# Altium schematic sheet LED Section.SchDoc
size A; DocumentNumber: 6; SheetNumber: 8; SheetTotal: 30
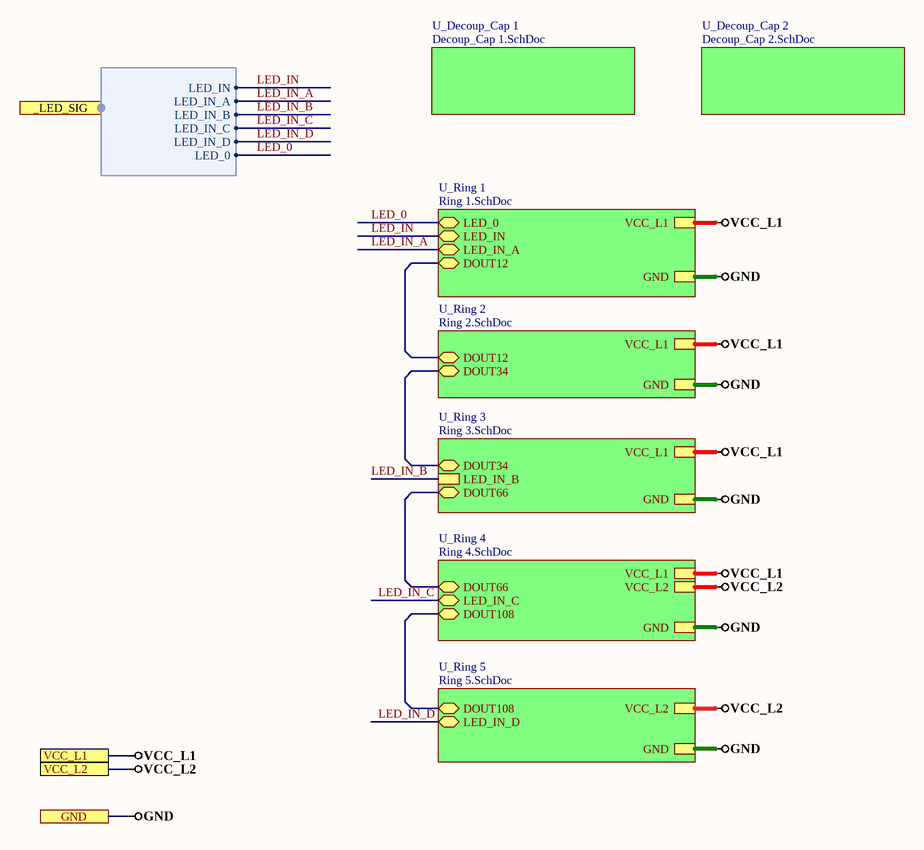
[diagram p0: LED Section.SchDoc]

## Sub-sheets
U_Decoup_Cap 1 = Decoup_Cap 1.SchDoc: no entries
U_Decoup_Cap 2 = Decoup_Cap 2.SchDoc: no entries
U_Ring 1 = Ring 1.SchDoc: DOUT12 (bidir), LED_IN (bidir), GND, VCC_L1, LED_IN_A (bidir), LED_0 (bidir)
U_Ring 2 = Ring 2.SchDoc: DOUT12 (bidir), DOUT34 (bidir), GND, VCC_L1
U_Ring 3 = Ring 3.SchDoc: DOUT34 (bidir), DOUT66 (bidir), GND, VCC_L1, LED_IN_B
U_Ring 4 = Ring 4.SchDoc: DOUT108 (bidir), DOUT66 (bidir), GND, VCC_L2, VCC_L1, LED_IN_C (bidir)
U_Ring 5 = Ring 5.SchDoc: DOUT108 (bidir), GND, VCC_L2, LED_IN_D (bidir)

## Ports
_LED_SIG (harness Harness_8), GND, VCC_L1, VCC_L2

## Harnesses
Harness_8: LED_IN, LED_IN_A, LED_IN_B, LED_IN_C, LED_IN_D, LED_0

## Nets
GND: port GND, sheet U_Ring 1/GND, sheet U_Ring 2/GND, sheet U_Ring 3/GND, sheet U_Ring 4/GND, sheet U_Ring 5/GND
VCC_L1: port VCC_L1, sheet U_Ring 1/VCC_L1, sheet U_Ring 2/VCC_L1, sheet U_Ring 3/VCC_L1, sheet U_Ring 4/VCC_L1
VCC_L2: port VCC_L2, sheet U_Ring 4/VCC_L2, sheet U_Ring 5/VCC_L2
LED_0: sheet U_Ring 1/LED_0, port _LED_SIG.LED_0
LED_IN: sheet U_Ring 1/LED_IN, port _LED_SIG.LED_IN
LED_IN_A: sheet U_Ring 1/LED_IN_A, port _LED_SIG.LED_IN_A
LED_IN_B: sheet U_Ring 3/LED_IN_B, port _LED_SIG.LED_IN_B
LED_IN_C: sheet U_Ring 4/LED_IN_C, port _LED_SIG.LED_IN_C
LED_IN_D: sheet U_Ring 5/LED_IN_D, port _LED_SIG.LED_IN_D
(unnamed): sheet U_Ring 1/DOUT12, sheet U_Ring 2/DOUT12
(unnamed): sheet U_Ring 2/DOUT34, sheet U_Ring 3/DOUT34
(unnamed): sheet U_Ring 3/DOUT66, sheet U_Ring 4/DOUT66
(unnamed): sheet U_Ring 4/DOUT108, sheet U_Ring 5/DOUT108